# Altium schematic sheet MicrocontrollerDataCollection.SchDoc
size Letter; SheetNumber: 2; SheetTotal: 5
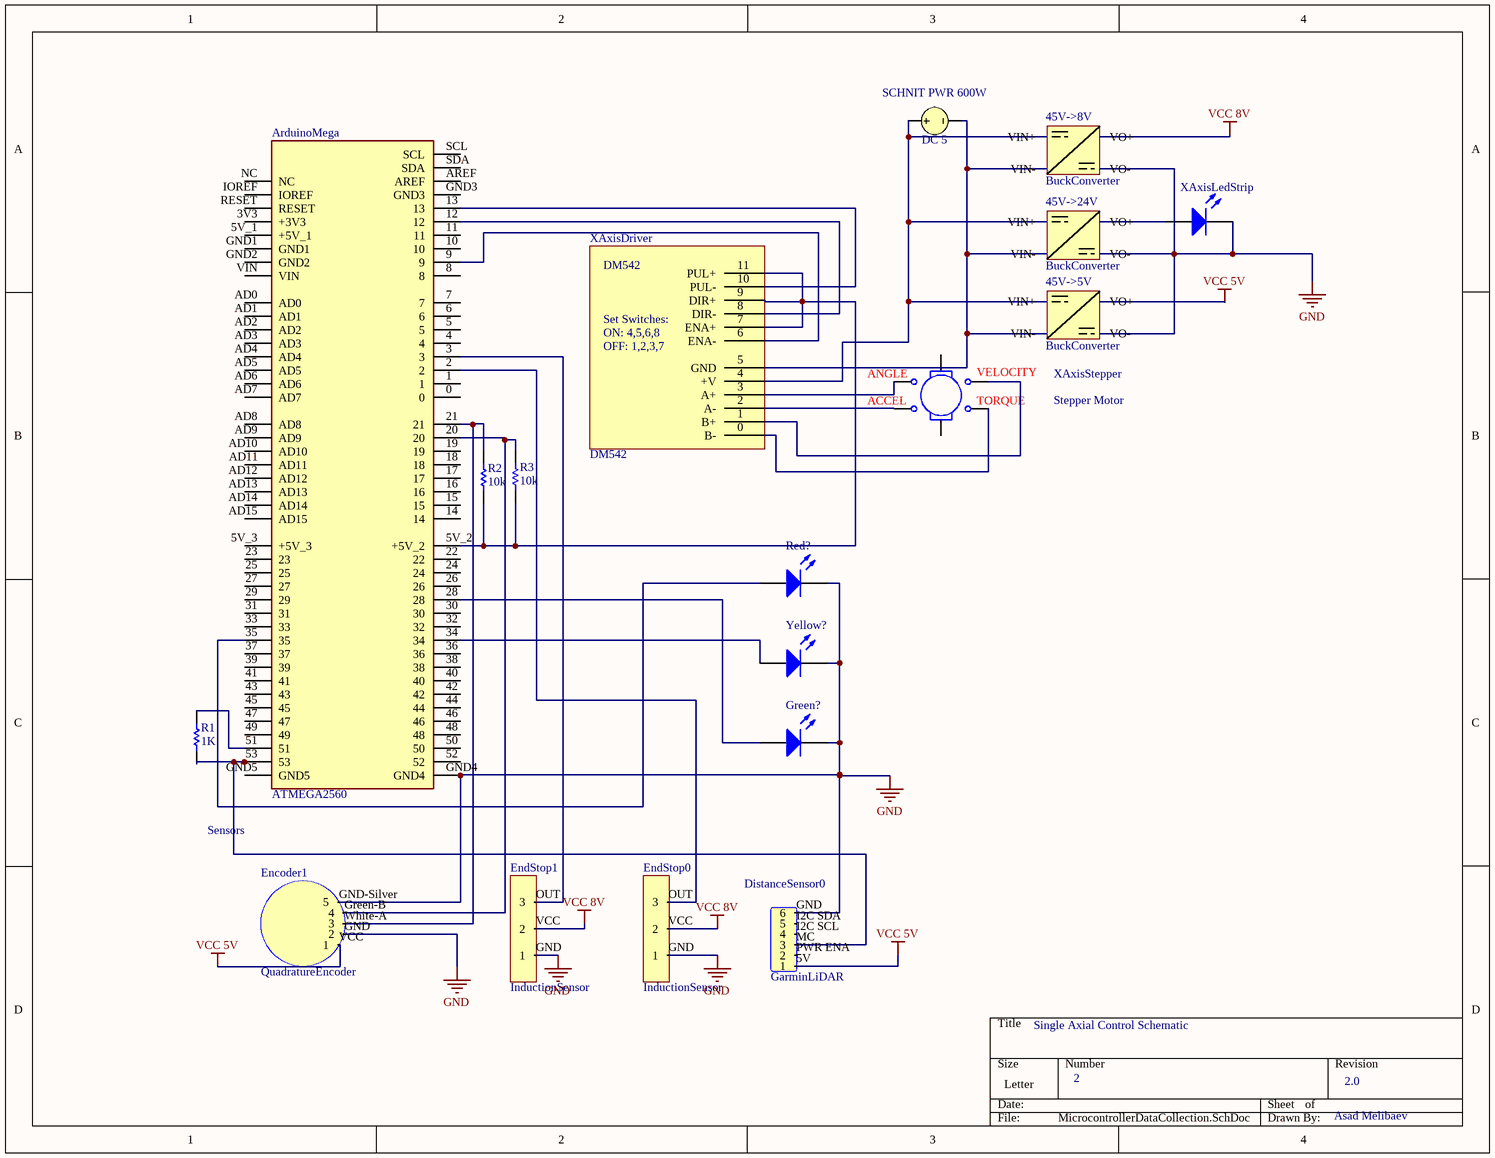
[diagram p0: MicrocontrollerDataCollection.SchDoc]

## Parts
45V->5V  BuckConverter
45V->8V  BuckConverter
45V->24V  BuckConverter
ArduinoMega  ATMEGA2560  [ARDUINO_A000067]
DistanceSensor0  GarminLiDAR
Encoder1  QuadratureEncoder
EndStop0  InductionSensor
EndStop1  InductionSensor
Green?  Light-Emitting Diode  (value not drawn)
R1  value 1K  (hidden comment: Resistor)
R2  R2: 10k  (hidden comment: Resistor)
R3  R33: 10k  (hidden comment: Resistor)
Red?  Light-Emitting Diode  (value not drawn)
SCHNIT_PWR_600W  DC 5
XAxisDriver  DM542
XAxisLedStrip  Light-Emitting Diode  (value not drawn)
XAxisStepper  Stepper Motor
Yellow?  Light-Emitting Diode  (value not drawn)

## Nets
GND: 45V->5V.1(VO-) 45V->8V.1(VO-) 45V->24V.1(VO-) ArduinoMega.GND4 DistanceSensor0.GND(6) Encoder1.GND(2) Encoder1.GND-Silver(5) EndStop0.GND(1) EndStop1.GND(1) Green?.2(K) Red?.2(K) XAxisLedStrip.2(K) Yellow?.2(K)
VCC 5V: 45V->5V.0(VO+) DistanceSensor0.5V(1) Encoder1.VCC(1)
VCC 8V: 45V->8V.0(VO+) EndStop0.VCC(2) EndStop1.VCC(2)
Net45V->5V_2: 45V->5V.2(VIN+) 45V->8V.2(VIN+) 45V->24V.2(VIN+) SCHNIT_PWR_600W.1 XAxisDriver.4(+V)
Net45V->5V_3: 45V->5V.3(VIN-) 45V->8V.3(VIN-) 45V->24V.3(VIN-) SCHNIT_PWR_600W.2 XAxisDriver.5(GND)
Net45V->24V_0: 45V->24V.0(VO+) XAxisLedStrip.1(A)
NetArduinoMega_2: ArduinoMega.2 EndStop0.OUT(3)
NetArduinoMega_3: ArduinoMega.3 EndStop1.OUT(3)
NetArduinoMega_5V_2: ArduinoMega.5V_2(+5V_2) R2.1 R3.1 XAxisDriver.7(ENA+) XAxisDriver.9(DIR+) XAxisDriver.11(PUL+)
NetArduinoMega_9: ArduinoMega.9 XAxisDriver.6(ENA-)
NetArduinoMega_12: ArduinoMega.12 XAxisDriver.8(DIR-)
NetArduinoMega_13: ArduinoMega.13 XAxisDriver.10(PUL-)
NetArduinoMega_20: ArduinoMega.20 Encoder1.Green-B(4) R3.2
NetArduinoMega_21: ArduinoMega.21 Encoder1.White-A(3) R2.2
NetArduinoMega_28: ArduinoMega.28 Green?.1(A)
NetArduinoMega_34: ArduinoMega.34 Yellow?.1(A)
NetArduinoMega_35: ArduinoMega.35 Red?.1(A)
NetArduinoMega_51: ArduinoMega.51 R1.2
NetArduinoMega_53: ArduinoMega.53 DistanceSensor0.MC(3) R1.1
NetXAxisDriver_0: XAxisDriver.0(B-) XAxisStepper.5
NetXAxisDriver_1: XAxisDriver.1(B+) XAxisStepper.3
NetXAxisDriver_2: XAxisDriver.2(A-) XAxisStepper.6
NetXAxisDriver_3: XAxisDriver.3(A+) XAxisStepper.4

Not connected (* = marked no-connect by the designer): ArduinoMega 0 1 3V3(+3V3) 4 5 5V_1(+5V_1) 5V_3(+5V_3) 6 7 8 10 11 14 15 16 17 18 19 22 23 24 25 26 27 29 30 31 32 33 36 37 38 39 40 41 42 43 44 45 46 47 48 49 50 52 AD0 AD1 AD2 AD3 AD4 AD5 AD6 AD7 AD8 AD9 AD10 AD11 AD12 AD13 AD14 AD15 AREF GND1 GND2 GND3 GND5 IOREF NC RESET SCL SDA VIN; DistanceSensor0 I2C SCL(4) I2C SDA(5) PWR ENA(2); XAxisStepper 1 2

## Notes on the sheet
- Sensors
- Single Axial Control Schematic
- 2
- 2.0
- Asad Melibaev
- (in symbol DM542) Set Switches:; ON: 4,5,6,8; OFF: 1,2,3,7
- (in symbol Stepper Motor) ANGLE; VELOCITY; ACCEL; TORQUE

## Library data of the parts
45V->5V 45V->8V 45V->24V DistanceSensor0 Encoder1 EndStop0 EndStop1 = Component_1
ArduinoMega = A000067: 8-bit board with 54 digital pins, 16 analog inputs, and 4 serial ports.; MF: Arduino; MP: Arduino Mega 2560 Rev3; SnapEDA_Link: https://www.snapeda.com/parts/Arduino%20Mega%202560%20Rev3/Arduino/view-part/?ref=snap; Package: Non-Standard Arduino; Value: *; Check_prices: https://www.snapeda.com/parts/Arduino%20Mega%202560%20Rev3/Arduino/view-part/?ref=eda
Green? Red? XAxisLedStrip Yellow? = LED: AF: 1; BV: 0; BV_MAX: 1e99; EG: 1.11; FC: 0.5; IBV: 0.001; IS: 1e-14; MJSW: 0.33; NTUN: 30; TNOM: 27; XTI: 3; SimulationGenericComponent: True; CJO: 0; CJP: 0; CTA: 0; CTP: 0; FCS: 0.5; FV_MAX: 1e99; IKF: 0; IKR: 0; ISR: 1e-14; JSW: 0; JTUN: 0; JTUNSW: 0; KEG: 1; KF: 0; LEVEL: 1; N: 1; NBV: 1; NR: 1; NS: 1; PHP: 1; RS: 0; TCV: 0; TLEV: 0; TLEVC: 0; TM1: 0; TM2: 0; TPB: 0; TPHP: 0; TRS: 0; TRS2: 0; TT: 0; TTT1: 0; TTT2: 0; VJ: 1; XTITUN: 3
R1-R3 = Resistor: TC1: 0; SimulationGenericComponent: True; TC2: 0
SCHNIT_PWR_600W = VSRC: Voltage Source; Note: PCB Footprint - Not required; AC Magnitude: 1; AC Phase: 0; Value: 5; Published: 8-Jun-2000; LatestRevisionDate: 17-Jul-2002; LatestRevisionNote: Re-released for DXP Platform.; PackageReference: Not Applicable; Publisher: Altium Limited
XAxisStepper = Stepper Motor: K: .004545; KD: 120E-9; RS: 227; LS: 55MH; STEP_ANGLE: 18; TD: 1E-6; JMOTOR: 3.5E-9; JLOAD: 0; LIMIT: 5; HARDNESS: 0.1; SimulationGenericComponent: True; TLOAD: 0